# Altium project main_board.PrjPcb (part 1 of 2)
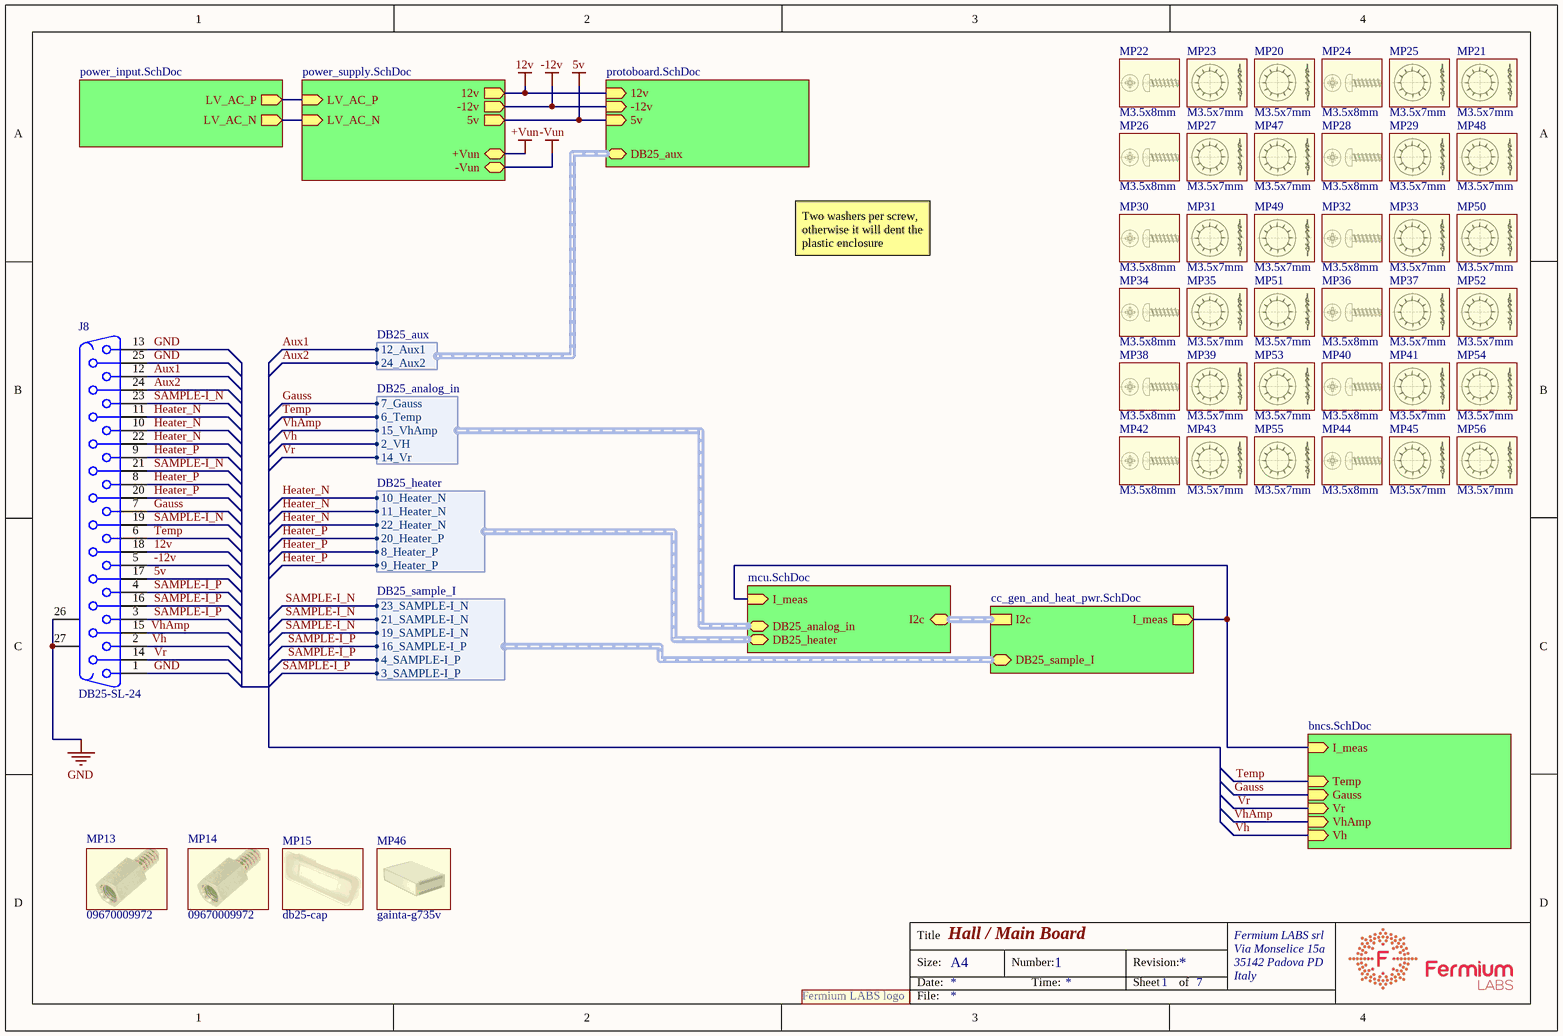
[diagram p0: main_board.SchDoc]
7 sheets, 247 parts. Net scope: hierarchical (ports join the sheet entries above them; power ports are global).
Board file: main_board.PcbDoc
Sheets:
  main_board.SchDoc
     = bncs.SchDoc
     = mcu.SchDoc
     = power_supply.SchDoc
     = cc_gen_and_heat_pwr.SchDoc
     = protoboard.SchDoc
     = power_input.SchDoc

## Sheet main_board.SchDoc: Hall / Main Board
size A4; DocumentNumber: 1; SheetNumber: 1; SheetTotal: 7

### Parts
J8  Supplier Part Number 1: DB25-SL-24  [DB25]
logo  (no value)  [frm-med]  (no BOM)
MP13  09670009972  (mechanical)
MP14  09670009972  (mechanical)
MP15  db25-cap  (mechanical)
MP20  Size: M3.5x7mm  (hidden comment: rondella-dentata-m3.5_1)  (mechanical)
MP21  Size: M3.5x7mm  (hidden comment: rondella-dentata-m3.5_1)  (mechanical)
MP22  Size: M3.5x8mm  (hidden comment: screw-3.5x8-plasticc_1)  (mechanical)
MP23  Size: M3.5x7mm  (hidden comment: rondella-dentata-m3.5_1)  (mechanical)
MP24  Size: M3.5x8mm  (hidden comment: screw-3.5x8-plasticc_1)  (mechanical)
MP25  Size: M3.5x7mm  (hidden comment: rondella-dentata-m3.5_1)  (mechanical)
MP26  Size: M3.5x8mm  (hidden comment: screw-3.5x8-plasticc_1)  (mechanical)
MP27  Size: M3.5x7mm  (hidden comment: rondella-dentata-m3.5_1)  (mechanical)
MP28  Size: M3.5x8mm  (hidden comment: screw-3.5x8-plasticc_1)  (mechanical)
MP29  Size: M3.5x7mm  (hidden comment: rondella-dentata-m3.5_1)  (mechanical)
MP30  Size: M3.5x8mm  (hidden comment: screw-3.5x8-plasticc_1)  (mechanical)
MP31  Size: M3.5x7mm  (hidden comment: rondella-dentata-m3.5_1)  (mechanical)
MP32  Size: M3.5x8mm  (hidden comment: screw-3.5x8-plasticc_1)  (mechanical)
MP33  Size: M3.5x7mm  (hidden comment: rondella-dentata-m3.5_1)  (mechanical)
MP34  Size: M3.5x8mm  (hidden comment: screw-3.5x8-plasticc_1)  (mechanical)
MP35  Size: M3.5x7mm  (hidden comment: rondella-dentata-m3.5_1)  (mechanical)
MP36  Size: M3.5x8mm  (hidden comment: screw-3.5x8-plasticc_1)  (mechanical)
MP37  Size: M3.5x7mm  (hidden comment: rondella-dentata-m3.5_1)  (mechanical)
MP38  Size: M3.5x8mm  (hidden comment: screw-3.5x8-plasticc_1)  (mechanical)
MP39  Size: M3.5x7mm  (hidden comment: rondella-dentata-m3.5_1)  (mechanical)
MP40  Size: M3.5x8mm  (hidden comment: screw-3.5x8-plasticc_1)  (mechanical)
MP41  Size: M3.5x7mm  (hidden comment: rondella-dentata-m3.5_1)  (mechanical)
MP42  Size: M3.5x8mm  (hidden comment: screw-3.5x8-plasticc_1)  (mechanical)
MP43  Size: M3.5x7mm  (hidden comment: rondella-dentata-m3.5_1)  (mechanical)
MP44  Size: M3.5x8mm  (hidden comment: screw-3.5x8-plasticc_1)  (mechanical)
MP45  Size: M3.5x7mm  (hidden comment: rondella-dentata-m3.5_1)  (mechanical)
MP46  gainta-g735v  (mechanical)
MP47  Size: M3.5x7mm  (hidden comment: rondella-dentata-m3.5_1)  (mechanical)
MP48  Size: M3.5x7mm  (hidden comment: rondella-dentata-m3.5_1)  (mechanical)
MP49  Size: M3.5x7mm  (hidden comment: rondella-dentata-m3.5_1)  (mechanical)
MP50  Size: M3.5x7mm  (hidden comment: rondella-dentata-m3.5_1)  (mechanical)
MP51  Size: M3.5x7mm  (hidden comment: rondella-dentata-m3.5_1)  (mechanical)
MP52  Size: M3.5x7mm  (hidden comment: rondella-dentata-m3.5_1)  (mechanical)
MP53  Size: M3.5x7mm  (hidden comment: rondella-dentata-m3.5_1)  (mechanical)
MP54  Size: M3.5x7mm  (hidden comment: rondella-dentata-m3.5_1)  (mechanical)
MP55  Size: M3.5x7mm  (hidden comment: rondella-dentata-m3.5_1)  (mechanical)
MP56  Size: M3.5x7mm  (hidden comment: rondella-dentata-m3.5_1)  (mechanical)

### Sub-sheets
? = bncs.SchDoc: Temp (in), Gauss (in), I_meas (in), Vr (in), VhAmp (in), Vh (in)
? = mcu.SchDoc: I2c (harness I2c), I_meas (in), DB25_analog_in (harness DB25_analog_in), DB25_heater (harness DB25_heater)
? = power_supply.SchDoc: 12v (out), -12v (out), 5v (out), LV_AC_P (in), LV_AC_N (in), +Vun, -Vun
? = cc_gen_and_heat_pwr.SchDoc: I2c (harness I2c), I_meas (out), DB25_sample_I (harness DB25_sample_I)
? = protoboard.SchDoc: 12v (in), -12v (in), 5v (in), DB25_aux (harness DB25_aux)
? = power_input.SchDoc: LV_AC_P (out), LV_AC_N (out)

### Harnesses
DB25_analog_in: 14_Vr, 15_VhAmp, 2_VH, 6_Temp, 7_Gauss
DB25_heater: 10_Heater_N, 11_Heater_N, 20_Heater_P, 22_Heater_N, 8_Heater_P, 9_Heater_P
DB25_sample_I: 16_SAMPLE-I_P, 19_SAMPLE-I_N, 21_SAMPLE-I_N, 23_SAMPLE-I_N, 3_SAMPLE-I_P, 4_SAMPLE-I_P
DB25_aux: 12_Aux1, 24_Aux2

### Nets
5v: J8.17 ; sheet /5v, sheet /5v
12v: J8.18 ; sheet /12v, sheet /12v
-12v: J8.5 ; sheet /-12v, sheet /-12v
GND: J8.1 J8.13 J8.25 J8.26(MH1) J8.27(MH2)
Aux1: J8.12 ; sheet /DB25_aux.12_Aux1
Aux2: J8.24 ; sheet /DB25_aux.24_Aux2
Gauss: J8.7 ; sheet /Gauss, sheet /DB25_analog_in.7_Gauss
Heater_N: J8.10 J8.11 J8.22 ; sheet /DB25_heater.10_Heater_N, sheet /DB25_heater.11_Heater_N, sheet /DB25_heater.22_Heater_N
Heater_P: J8.8 J8.9 J8.20 ; sheet /DB25_heater.20_Heater_P, sheet /DB25_heater.8_Heater_P, sheet /DB25_heater.9_Heater_P
SAMPLE-I_N: J8.19 J8.21 J8.23 ; sheet /DB25_sample_I.19_SAMPLE-I_N, sheet /DB25_sample_I.21_SAMPLE-I_N, sheet /DB25_sample_I.23_SAMPLE-I_N
SAMPLE-I_P: J8.3 J8.4 J8.16 ; sheet /DB25_sample_I.16_SAMPLE-I_P, sheet /DB25_sample_I.3_SAMPLE-I_P, sheet /DB25_sample_I.4_SAMPLE-I_P
Temp: J8.6 ; sheet /Temp, sheet /DB25_analog_in.6_Temp
Vh: J8.2 ; sheet /Vh, sheet /DB25_analog_in.2_VH
VhAmp: J8.15 ; sheet /VhAmp, sheet /DB25_analog_in.15_VhAmp
Vr: J8.14 ; sheet /Vr, sheet /DB25_analog_in.14_Vr
NetD1_A: sheet /I_meas, sheet /I_meas, sheet /I_meas
NetD19_A: sheet /LV_AC_P, sheet /LV_AC_P
NetD20_A: sheet /LV_AC_N, sheet /LV_AC_N

### Notes on the sheet
- Two washers per screw, otherwise it will dent the plastic enclosure
- Title
- Size:
- Date:
- A4
- Number:
- Time:
- Revision:
- Sheet
- of
- Fermium LABS srl
- Via Monselice 15a
- 35142 Padova PD
- Italy
- File:
- (in symbol fermiumlabs-logo) Fermium LABS logo

### Library data of the parts
J8 = D Connector 25: d-sub, 25 pins,  Right Angle; Manufacturer: ADAM TECH; Pads: 29 THT; Supplier 1: TME; Manufacturer Part Number: DB25-SL-24; Category: D-Sub connectors
logo = fermiumlabs-logo
MP13 MP14 = 09670009972: Manufacturer: HARTING; Supplier 1: TME; Supplier Part Number 1: 09670009972; Manufacturer Part Number: 09670009972
MP15 = db25-cap: Manufacturer Part Number: 2105-0100-03; Manufacturer: Encitech; Supplier 1: TME; Supplier Part Number 1: DC25-P
MP20 MP21 MP23 MP25 MP27 MP29 MP31 MP33 MP35 MP37 MP39 MP41 MP43 MP45 MP47-MP56 = rondella-dentata-m3.5_1: Manufacturer Part Number: M3.5/BN782 DIN6798J; Manufacturer: BOSSARD; Supplier 1: TME; Supplier Part Number 1: B3.5/BN782
MP22 MP24 MP26 MP28 MP30 MP32 MP34 MP36 MP38 MP40 MP42 MP44 = screw-3.5x8-plasticc_1: Manufacturer Part Number: M3.5X8/BN82428; Manufacturer: BOSSARD; Supplier 1: TME; Supplier Part Number 1: B3.5X8/BN82428
MP46 = gainta-g735v: Manufacturer Part Number: G735V; Manufacturer: GAINTA; Supplier 1: TME; Supplier Part Number 1: G735V

## Sheet bncs.SchDoc: Hall / Main Board / BNCs
size A4; DocumentNumber: 2; SheetNumber: 2; SheetTotal: 7
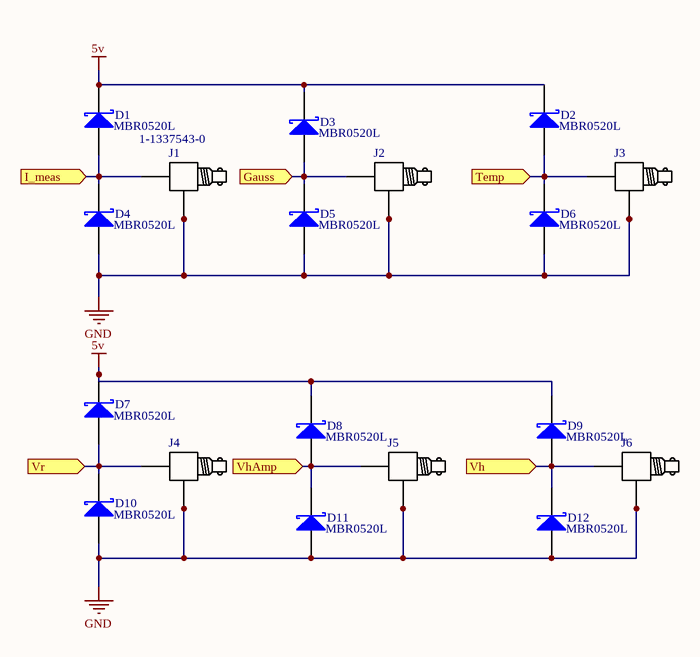
[diagram p1: bncs.SchDoc]

### Parts
D1  Supplier Part Number 1: MBR0520L  [SOD123]
D2  Supplier Part Number 1: MBR0520L  [SOD123]
D3  Supplier Part Number 1: MBR0520L  [SOD123]
D4  Supplier Part Number 1: MBR0520L  [SOD123]
D5  Supplier Part Number 1: MBR0520L  [SOD123]
D6  Supplier Part Number 1: MBR0520L  [SOD123]
D7  Supplier Part Number 1: MBR0520L  [SOD123]
D8  Supplier Part Number 1: MBR0520L  [SOD123]
D9  Supplier Part Number 1: MBR0520L  [SOD123]
D10  Supplier Part Number 1: MBR0520L  [SOD123]
D11  Supplier Part Number 1: MBR0520L  [SOD123]
D12  Supplier Part Number 1: MBR0520L  [SOD123]
J1  Supplier Part Number 1: 1-1337543-0  [BNC-RA]
J2  (no value)  [BNC-RA]
J3  (no value)  [BNC-RA]
J4  (no value)  [BNC-RA]
J5  (no value)  [BNC-RA]
J6  (no value)  [BNC-RA]

### Ports
Gauss (in), I_meas (in), Temp (in), Vh (in), VhAmp (in), Vr (in)

### Nets
5v: D1.K D2.K D3.K D7.K D8.K D9.K
GND: D4.A D5.A D6.A D10.A D11.A D12.A J1.2(gnd) J1.A J1.B J2.2(gnd) J2.A J2.B J3.2(gnd) J3.A J3.B J4.2(gnd) J4.A J4.B J5.2(gnd) J5.A J5.B J6.2(gnd) J6.A J6.B
Gauss: D3.A D5.K J2.1 ; port Gauss
Temp: D2.A D6.K J3.1 ; port Temp
Vh: D9.A D12.K J6.1 ; port Vh
VhAmp: D8.A D11.K J5.1 ; port VhAmp
Vr: D7.A D10.K J4.1 ; port Vr
NetD1_A: D1.A D4.K J1.1 ; port I_meas

### Notes on the sheet
- Title
- Size:
- Date:
- A4
- Number:
- Time:
- Revision:
- Sheet
- of
- Fermium LABS srl
- Via Monselice 15a
- 35142 Padova PD
- Italy
- File:

### Library data of the parts
D1-D9 D11 D12 = D Schottky: Schottky Diode; Manufacturer: FAIRCHILD SEMICONDUCTOR; Unit: pcs; SuppliedAmount: 0; MinAmount: 10; Multiples: 1; Diode type: Schottky rectifying; Off state voltage max.: 20V; Forward voltage at If: 390mV; Load current: 500mA; Pads: 2 SMD; Published: 8-Jun-2000; LatestRevisionDate: 17-Jul-2002; LatestRevisionNote: Re-released for DXP Platform.; PackageReference: SMB; Publisher: Altium Limited; PackageDescription: DO-214-AA/SMB; 2 C-Bend Leads; Body 5.3 x 3.6 mm, inc. leads (LxW); Code_JEDEC: DO-214-AA; Supplier 1: TME; Manufacturer Part Number: MBR0520L; Category: SMD Schottky Diodes; Stock 1: 24595; Pricing 1: 10=0.0403, 50=0.0376, 250=0.0333, 1000=0.03, 3000=0.0281 (EUR); Weight: 0.032; Case: SOD123; Mounting: SMD; Price Type: NET; ComponentLink1URL: http://static.tme.eu/products_pics/e/d/b/edbd030cb344fc64745afa0f91101952/285567.jpg; ComponentLink1Description: http://static.tme.eu/products_pics/e/d/b/edbd030cb344fc64745afa0f91101952/285567.jpg
D10 = D Schottky: Schottky Diode; Manufacturer: FAIRCHILD SEMICONDUCTOR; Unit: pcs; SuppliedAmount: 0; MinAmount: 10; Multiples: 1; Diode type: Schottky rectifying; Off state voltage max.: 20V; Forward voltage at If: 390mV; Load current: 500mA; 2: SMD; Pads: 2 SMD; Published: 8-Jun-2000; LatestRevisionDate: 17-Jul-2002; LatestRevisionNote: Re-released for DXP Platform.; PackageReference: SMB; Publisher: Altium Limited; PackageDescription: DO-214-AA/SMB; 2 C-Bend Leads; Body 5.3 x 3.6 mm, inc. leads (LxW); Code_JEDEC: DO-214-AA; Supplier 1: TME; Manufacturer Part Number: MBR0520L; Category: SMD Schottky Diodes; Stock 1: 24595; Pricing 1: 10=0.0403, 50=0.0376, 250=0.0333, 1000=0.03, 3000=0.0281 (EUR); Weight: 0.032; Case: SOD123; Mounting: SMD; Price Type: NET; ComponentLink1URL: http://static.tme.eu/products_pics/e/d/b/edbd030cb344fc64745afa0f91101952/285567.jpg; ComponentLink1Description: http://static.tme.eu/products_pics/e/d/b/edbd030cb344fc64745afa0f91101952/285567.jpg
J1 = BNC-PCB-RA: connector bnc; Manufacturer: TE CONNECTIVITY; Unit: pcs; SuppliedAmount: 0; MinAmount: 1; Connector: socket; Connector variant: insulated; Spatial orientation: angled 90°; Wave impedance: 50Ω; Electrical mounting: THT; Mechanical mounting: on PCBs; Insulator material: polyester; Pads: 4 THT; Supplier 1: TME; Manufacturer Part Number: 1-1337543-0; Category: BNC connectors; Stock 1: 44; Pricing 1: 1=1.22, 25=1.1, 100=0.98, 1000=0.86 (EUR); Weight: 13.22; Multiples: 1; Connector type: BNC; Contact plating: gold plated; Price Type: NET; ComponentLink1URL: http://static.tme.eu/products_pics/6/3/2/63240353f8a8790dbe8f7bd93b014c1a/378606.jpg; ComponentLink1Description: http://static.tme.eu/products_pics/6/3/2/63240353f8a8790dbe8f7bd93b014c1a/378606.jpg
J2-J6 = BNC-PCB-RA: connector bnc; Manufacturer: TE CONNECTIVITY; Manufacturer Part Number: 1-1337543-0; Unit: pcs; SuppliedAmount: 0; MinAmount: 1; Connector: socket; Connector variant: insulated; Spatial orientation: angled 90°; Wave impedance: 50Ω; Electrical mounting: THT; Mechanical mounting: on PCBs; Insulator material: polyester; Pads: 4 THT; Supplier 1: TME; Supplier Part Number 1: 1-1337543-0; Category: BNC connectors; Stock 1: 44; Pricing 1: 1=1.22, 25=1.1, 100=0.98, 1000=0.86 (EUR); Weight: 13.22; Multiples: 1; Connector type: BNC; Contact plating: gold plated; Price Type: NET; ComponentLink1URL: http://static.tme.eu/products_pics/6/3/2/63240353f8a8790dbe8f7bd93b014c1a/378606.jpg; ComponentLink1Description: http://static.tme.eu/products_pics/6/3/2/63240353f8a8790dbe8f7bd93b014c1a/378606.jpg

## Sheet mcu.SchDoc: Hall / Main Board / MCU and ADCs
size A4; DocumentNumber: 4; SheetNumber: 4; SheetTotal: 7
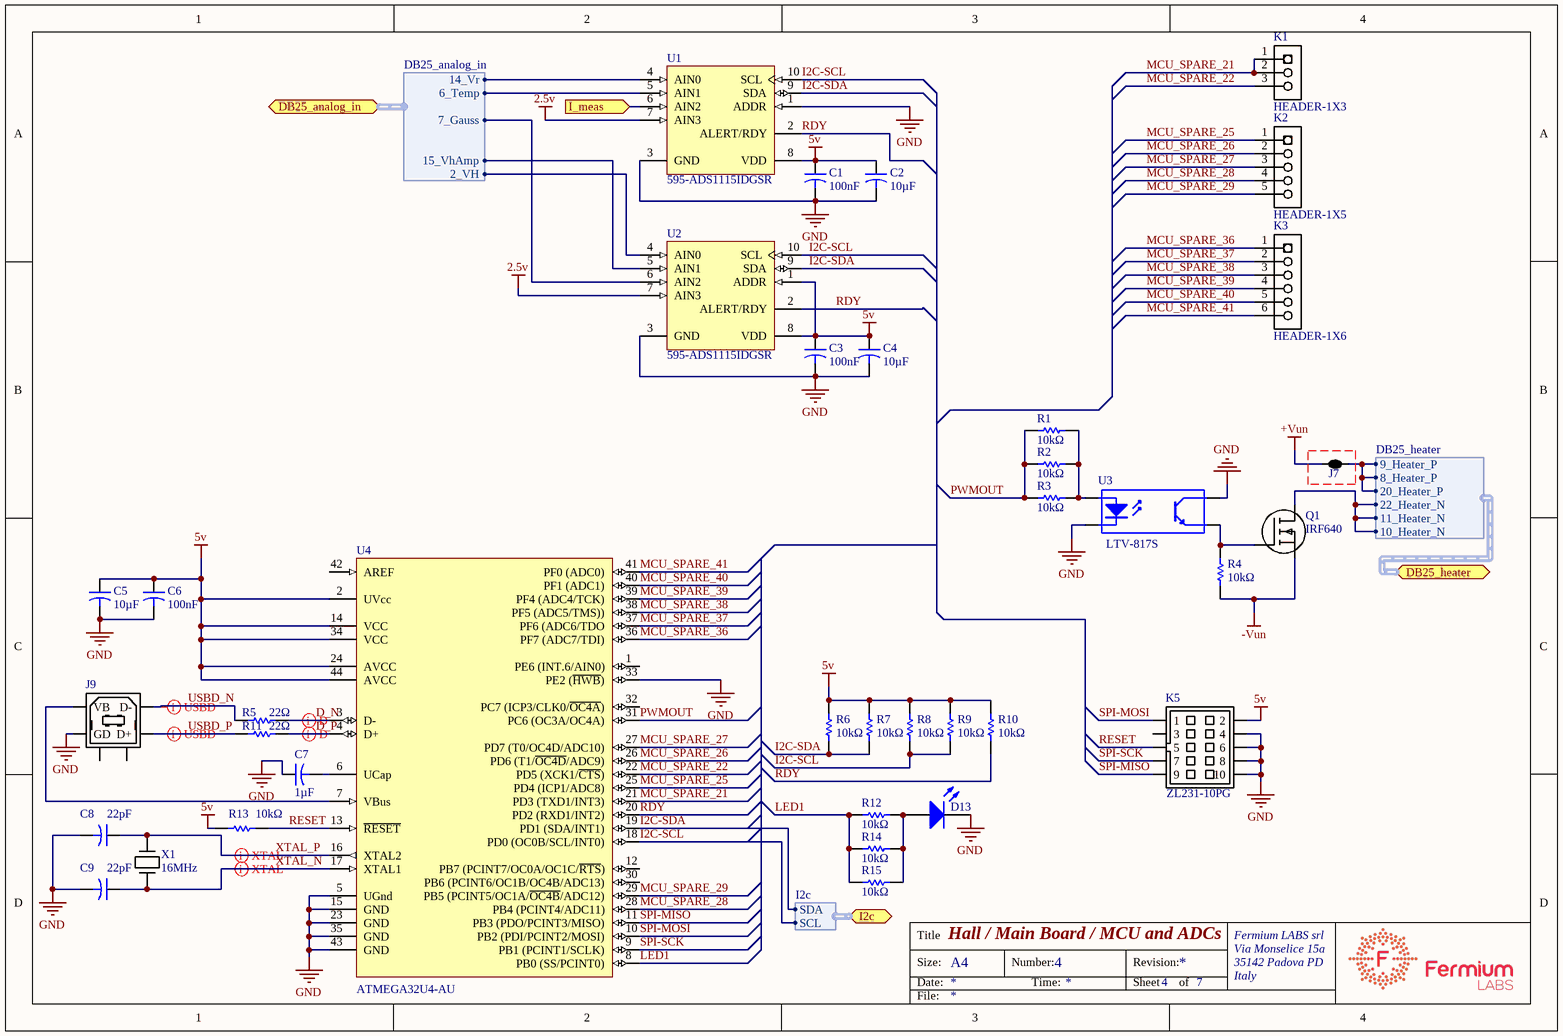
[diagram p2: mcu.SchDoc]

### Parts
C1  Capacitance: 100nF  [CAP 0805/2012]
C2  Capacitance: 10µF  [CAP 1206/3216]
C3  Capacitance: 100nF  [CAP 0805/2012]
C4  Capacitance: 10µF  [CAP 1206/3216]
C5  Capacitance: 10µF  [CAP 1206/3216]
C6  Capacitance: 100nF  [CAP 0805/2012]
C7  Capacitance: 1µF  [CAP 0805/2012]
C8  Capacitance: 22pF  [CAP 0805/2012]
C9  Capacitance: 22pF  [CAP 0805/2012]
D13  (no value)  [LED-0]
J7  2 way net tie junction  [2way_LP]  (value not drawn)  (net tie, no BOM)
J9  (no value)  [USB_TypeB]
K1  HEADER-1X3  [HEADER-1X3]  (no BOM)
K2  HEADER-1X5  [HEADER-1X5]  (no BOM)
K3  HEADER-1X6  [HEADER-1X6]  (no BOM)
K5  Supplier Part Number 1: ZL231-10PG  [IDC10-B]
Q1  IRF640  [DPAK-GDS]
R1  Resistance: 10kΩ  [RES 0805/2012]
R2  Resistance: 10kΩ  [RES 0805/2012]
R3  Resistance: 10kΩ  [RES 0805/2012]
R4  Resistance: 10kΩ  [RES 0805/2012]
R5  Resistance: 22Ω  [RES 0805/2012]
R6  Resistance: 10kΩ  [RES 0805/2012]
R7  Resistance: 10kΩ  [RES 0805/2012]
R8  Resistance: 10kΩ  [RES 0805/2012]
R9  Resistance: 10kΩ  [RES 0805/2012]
R10  Resistance: 10kΩ  [RES 0805/2012]
R11  Resistance: 22Ω  [RES 0805/2012]
R12  Resistance: 10kΩ  [RES 0805/2012]
R13  Resistance: 10kΩ  [RES 0805/2012]  (hidden comment: Res1)
R14  Resistance: 10kΩ  [RES 0805/2012]
R15  Resistance: 10kΩ  [RES 0805/2012]
U1  Supplier Part Number 1: 595-ADS1115IDGSR  [TI-DGS10_N]
U2  Supplier Part Number 1: 595-ADS1115IDGSR  [TI-DGS10_N]
U3  Supplier Part Number 1: LTV-817S  [gullwing-opto-4]  (hidden comment: LTV-817)
U4  (no value)  [44ML_N]
X1  Frequency: 16MHz  [ABRACON ABLS]

### Ports
DB25_analog_in (harness DB25_analog_in), DB25_heater (harness DB25_heater), I2c (harness I2c), I_meas (in)

### Harnesses
DB25_analog_in: 14_Vr, 15_VhAmp, 2_VH, 6_Temp, 7_Gauss
I2c: SCL, SDA
DB25_heater: 10_Heater_N, 11_Heater_N, 20_Heater_P, 22_Heater_N, 8_Heater_P, 9_Heater_P

### Nets
2.5v: U1.7(AIN3) U2.7(AIN3)
5v: C1.1 C2.1 C3.1 C4.1 C5.1 C6.1 K5.2 R6.2 R7.2 R8.2 R9.2 R10.2 R13.2 U1.8(VDD) U2.1(ADDR) U2.8(VDD) U4.2(UVcc) U4.14(VCC) U4.24(AVCC) U4.34(VCC) U4.44(AVCC)
+Vun: J7.1
-Vun: Q1.S R4.1
GND: C1.2 C2.2 C3.2 C4.2 C5.2 C6.2 C7.1 C8.2 C9.2 D13.1(K) J9.4(GD) K5.4 K5.6 K5.8 K5.10 U1.1(ADDR) U1.3(GND) U2.3(GND) U3.2(K) U3.4(C) U4.5(UGnd) U4.15(GND) U4.23(GND) U4.33(PE2_(~{HWB})) U4.35(GND) U4.43(GND)
D_N: R5.1 U4.3(D-)
D_P: R11.1 U4.4(D+)
Gauss: U2.6(AIN2) ; port DB25_analog_in.7_Gauss
Heater_N: Q1.D ; port DB25_heater.10_Heater_N, port DB25_heater.11_Heater_N, port DB25_heater.22_Heater_N
Heater_P: J7.2 ; port DB25_heater.20_Heater_P, port DB25_heater.8_Heater_P, port DB25_heater.9_Heater_P
I2C-SCL: R8.1 R9.1 U1.10(SCL) U2.10(SCL) U4.18(PD0_(OC0B/SCL/INT0)) ; port I2c.SCL
I2C-SDA: R6.1 R7.1 U1.9(SDA) U2.9(SDA) U4.19(PD1_(SDA/INT1)) ; port I2c.SDA
LED1: R12.2 R14.2 R15.2 U4.8(PB0_(SS/PCINT0))
MCU_SPARE_21: K1.1 K1.2 U4.21(PD3_(TXD1/INT3))
MCU_SPARE_22: K1.3 U4.22(PD5_(XCK1/~{CTS}))
MCU_SPARE_25: K2.1 U4.25(PD4_(ICP1/ADC8))
MCU_SPARE_26: K2.2 U4.26(PD6_(T1/~{OC4D}/ADC9))
MCU_SPARE_27: K2.3 U4.27(PD7_(T0/OC4D/ADC10))
MCU_SPARE_28: K2.4 U4.28(PB4_(PCINT4/ADC11))
MCU_SPARE_29: K2.5 U4.29(PB5_(PCINT5/OC1A/~{OC4B}/ADC12))
MCU_SPARE_36: K3.1 U4.36(PF7_(ADC7/TDI))
MCU_SPARE_37: K3.2 U4.37(PF6_(ADC6/TDO)
MCU_SPARE_38: K3.3 U4.38(PF5_(ADC5/TMS)))
MCU_SPARE_39: K3.4 U4.39(PF4_(ADC4/TCK))
MCU_SPARE_40: K3.5 U4.40(PF1_(ADC1))
MCU_SPARE_41: K3.6 U4.41(PF0_(ADC0))
PWMOUT: R1.2 R2.2 R3.2 U4.31(PC6_(OC3A/OC4A))
RDY: R10.1 U1.2(ALERT/RDY) U2.2(ALERT/RDY) U4.20(PD2_(RXD1/INT2))
RESET: K5.5 R13.1 U4.13(~{RESET})
SPI-MISO: K5.9 U4.11(PB3_(PDO/PCINT3/MISO))
SPI-MOSI: K5.1 U4.10(PB2_(PDI/PCINT2/MOSI))
SPI-SCK: K5.7 U4.9(PB1_(PCINT1/SCLK))
Temp: U1.5(AIN1) ; port DB25_analog_in.6_Temp
USBD_N: J9.2(D-) R5.2
USBD_P: J9.3(D+) R11.2
Vh: U2.4(AIN0) ; port DB25_analog_in.2_VH
VhAmp: U2.5(AIN1) ; port DB25_analog_in.15_VhAmp
Vr: U1.4(AIN0) ; port DB25_analog_in.14_Vr
XTAL_N: C9.1 U4.17(XTAL1) X1.2
XTAL_P: C8.1 U4.16(XTAL2) X1.1
NetC7_2: C7.2 U4.6(UCap)
NetD1_A: U1.6(AIN2) ; port I_meas
NetD13_2: D13.2(A) R12.1 R14.1 R15.1
NetJ9_1: J9.1(VB) U4.7(VBus)
NetQ1_G: Q1.G R4.2 U3.3(E)
NetR1_1: R1.1 R2.1 R3.1 U3.1(A)

Not connected (* = marked no-connect by the designer): J9 5 6; K5 3; U4 1(PE6_(INT.6/AIN0)) 12(PB7_(PCINT7/OC0A/OC1C/~{RTS})) 30(PB6_(PCINT6/OC1B/OC4B/ADC13)) 32(PC7_(ICP3/CLK0/~{OC4A})) 42(AREF)

### Layout directives
differential pair: D_N, D_P, USBD_N, USBD_P, XTAL_N, XTAL_P

### Notes on the sheet
- Title
- Size:
- Date:
- A4
- Number:
- Time:
- Revision:
- Sheet
- of
- Fermium LABS srl
- Via Monselice 15a
- 35142 Padova PD
- Italy
- File:

### Library data of the parts
C1 C3 C6 = Cap2: Capacitor; Manufacturer: YAGEO; Manufacturer Part Number: CC0805JRX7R9BB104; Unit: pcs; SuppliedAmount: 0; MinAmount: 100; Capacitor type: ceramic; Capacitor kind: MLCC; Operating voltage: 50V; Dielectric: X7R; Tolerance: ±5%; Case - inch: 0805; Case - mm: 2012; Pads: 2 SMD; Supplier 1: TME; Supplier Part Number 1: CC0805JRX7R9104; Category: 0805 MLCC SMD Capacitors; Stock 1: 89911; Pricing 1: 100=0.00613, 300=0.00464, 1000=0.00342, 4000=0.00284, 20000=0.00273 (EUR); Weight: 0.042; Multiples: 100; Mounting: SMD; Price Type: NET; ComponentLink1URL: http://static.tme.eu/products_pics/d/b/b/dbbd93eaf25225110ca26eb66da77328/58538.jpg; ComponentLink1Description: http://static.tme.eu/products_pics/d/b/b/dbbd93eaf25225110ca26eb66da77328/58538.jpg
C2 C4 C5 = Cap2: Capacitor; Manufacturer: SAMSUNG; Manufacturer Part Number: CL31A106KAHNNNE; Unit: pcs; SuppliedAmount: 0; MinAmount: 100; Capacitor type: ceramic; Capacitor kind: MLCC; Operating voltage: 25V; Dielectric: X5R; Tolerance: ±10%; Case - inch: 1206; Case - mm: 3216; Pads: 2 SMD; Published: 23-Sep-2002; PackageReference: CAPR5-4X5; Publisher: Altium Limited; PackageDescription: 1206; Supplier 1: TME; Supplier Part Number 1: CL31A106KAHNNNE; Category: 1206 MLCC SMD Capacitors; Stock 1: 279700; Pricing 1: 100=0.0248, 300=0.0203, 1000=0.0167, 2000=0.0131, 10000=0.0127 (EUR); Weight: 0.061; Multiples: 100; Mounting: SMD; Operating temperature: -55...85°C; Price Type: NET; ComponentLink1URL: http://static.tme.eu/products_pics/b/e/9/be9e0dd298dcf4979ea1dd3d226e0bfa/58780.jpg; ComponentLink1Description: http://static.tme.eu/products_pics/b/e/9/be9e0dd298dcf4979ea1dd3d226e0bfa/58780.jpg
C7 = Cap2: Capacitor; Manufacturer: SAMSUNG; Manufacturer Part Number: CL21B105KAFNNNE; Unit: pcs; SuppliedAmount: 0; MinAmount: 100; Capacitor type: ceramic; Capacitor kind: MLCC; Operating voltage: 25V; Dielectric: X7R; Tolerance: ±10%; Case - inch: 0805; Case - mm: 2012; Pads: 2 SMD; Published: 23-Sep-2002; PackageReference: CAPR5-4X5; Publisher: Altium Limited; PackageDescription: Capacitor; 2 Leads; Supplier 1: TME; Supplier Part Number 1: CL21B105KAFNNNE; Category: 0805 MLCC SMD Capacitors; Stock 1: 56790; Pricing 1: 100=0.0108, 300=0.00924, 1000=0.00748, 2000=0.006, 6000=0.0058 (EUR); Weight: 0.039; Multiples: 100; Mounting: SMD; Operating temperature: -55...125°C; Price Type: NET; ComponentLink1URL: http://static.tme.eu/products_pics/d/b/b/dbbd93eaf25225110ca26eb66da77328/58538.jpg; ComponentLink1Description: http://static.tme.eu/products_pics/d/b/b/dbbd93eaf25225110ca26eb66da77328/58538.jpg
C8 C9 = Cap2: Capacitor; Manufacturer: SAMSUNG; Manufacturer Part Number: CL21C220JBANNNC; Unit: pcs; SuppliedAmount: 0; MinAmount: 100; Capacitor type: ceramic; Capacitor kind: MLCC; Operating voltage: 50V; Dielectric: C0G; Tolerance: ±5%; Case - inch: 0805; Case - mm: 2012; Pads: 2 SMD; Published: 23-Sep-2002; PackageReference: CAPR5-4X5; Publisher: Altium Limited; PackageDescription: Capacitor; 2 Leads; Supplier 1: TME; Supplier Part Number 1: CL21C220JBANNNC; Category: 0805 MLCC SMD Capacitors; Stock 1: 298580; Pricing 1: 100=0.00603, 300=0.00435, 1000=0.00317, 4000=0.00171, 12000=0.00163 (EUR); Weight: 0.032; Multiples: 100; Mounting: SMD; Operating temperature: -55...125°C; Price Type: NET; ComponentLink1URL: http://static.tme.eu/products_pics/d/b/b/dbbd93eaf25225110ca26eb66da77328/58538.jpg; ComponentLink1Description: http://static.tme.eu/products_pics/d/b/b/dbbd93eaf25225110ca26eb66da77328/58538.jpg
D13 = LED0: LED red 5mm; Manufacturer: KINGBRIGHT ELECTRONIC; Manufacturer Part Number: L-1503CB/1ID; Unit: pcs; SuppliedAmount: 0; MinAmount: 5; Multiples: 1; LED version: in housing; Front: convex; LED lens: diffused; LED current: 20mA; Viewing angle: 60°; Operating voltage: 2...2.5V; Luminosity: 8-30mcd; Wavelength: 625nm; Pads: 2 THT; Supplier 1: TME; Supplier Part Number 1: L-1503CB/1ID; Category: LED Circuit Board Indicators; Stock 1: 1055; Pricing 1: 5=0.1308, 10=0.11837, 25=0.10529, 100=0.09483, 500=0.08829 (EUR); Weight: 0.4; Diode type: LED; LED colour: red; Mounting: THT; LED diameter: 5mm; Number of diodes: 1; Price Type: NET; ComponentLink1URL: http://static.tme.eu/products_pics/2/d/8/2d8734f7e5dfd4453dcfb445f87d0bf6/363629.jpg; ComponentLink1Description: http://static.tme.eu/products_pics/2/d/8/2d8734f7e5dfd4453dcfb445f87d0bf6/363629.jpg
J7 = 2way: ComponentLink1URL: http://www.edatools.cz/addons; ComponentLink1Description: Source; FootprintNote: LP=12mil, MP=40mil, HP=120mil
J9 = USB-B: USB b device connector; Manufacturer: LUMBERG; Manufacturer Part Number: 2411 02; Unit: pcs; SuppliedAmount: 0; MinAmount: 1; Connector: socket; Connector type: USB B; Mechanical mounting: on PCBs; Electrical mounting: THT; Spatial orientation: angled 90°; Variant: USB 2.0; Pads: 6 THT; Supplier 1: TME; Supplier Part Number 1: 2411-02; Category: USB & IEEE1394 connectors; Stock 1: 1211; Pricing 1: 1=0.58, 10=0.52, 50=0.46, 100=0.4 (EUR); Weight: 3.4; Multiples: 1; Number of pins: 4; Colour: white; Price Type: NET; ComponentLink1URL: http://static.tme.eu/products_pics/d/8/1/d81dedeb5f01696a6050c2c1b3ea9f71/397242.jpg; ComponentLink1Description: http://static.tme.eu/products_pics/d/8/1/d81dedeb5f01696a6050c2c1b3ea9f71/397242.jpg
K2 = HEADER-1X5: PINHEADER 1X5; REEL: TH; Supplier 1: Digi-Key; Supplier Part Number 1: S1011E-36-ND
K5 = IDC10: header 10pin, boxed; Manufacturer: NINIGI; Unit: pcs; SuppliedAmount: 0; MinAmount: 10; Connector: socket; Connector type: IDC; Spatial orientation: straight; Electrical mounting: THT; Contacts pitch: 2.54mm; Type of pin configuration: 2x5; Pads: 10 THT; Supplier 1: TME; Manufacturer Part Number: ZL231-10PG; Category: IDC connectors; Stock 1: 106380; Pricing 1: 10=0.08292, 50=0.07256, 200=0.06219, 1000=0.05183, 5000=0.04147 (EUR); Weight: 1.433; Multiples: 10; Number of pins: 10; Contact plating: gold plated; Price Type: NET; ComponentLink1URL: http://static.tme.eu/products_pics/2/9/e/29e35db67837c6e13659dd28b2765932/375255.jpg; ComponentLink1Description: http://static.tme.eu/products_pics/2/9/e/29e35db67837c6e13659dd28b2765932/375255.jpg
Q1 = IRLML2502: N CHANNEL MOSFET; Manufacturer Part Number: IRF640NSPBF; Pads: 3 SMD; Supplier 1: TME; Supplier Part Number 1: IRF640NSPBF
R1-R4 R6-R10 R12-R15 = Res1: Resistor; Manufacturer: YAGEO; Manufacturer Part Number: RC0805JR-0710KL; Unit: pcs; SuppliedAmount: 0; MinAmount: 100; Case - inch: 0805; Case - mm: 2012; Power: 0.125W; Tolerance: ±5%; Max. operating voltage: 150V; Max. overload voltage: 300V; Pads: 2 SMD; Published: 8-Jun-2000; LatestRevisionDate: 17-Jul-2002; LatestRevisionNote: Re-released for DXP Platform.; PackageReference: AXIAL-0.3; Publisher: Altium Limited; PackageDescription: Axial Device, Thru-Hole; 2 Leads; 0.3 in Pin Spacing; Supplier 1: TME; Supplier Part Number 1: RC0805JR-0710K; Category: 0805 SMD Resistors; Stock 1: 121900; Pricing 1: 100=0.006, 1000=0.0036, 5000=0.00118, 15000=0.00108, 50000=0.00094 (EUR); Weight: 0.028; Multiples: 100; Resistor type: thick film; Mounting: SMD; Operating temperature: -55...155°C; Price Type: NET; ComponentLink1URL: http://static.tme.eu/products_pics/6/6/c/66cc5cd64257edd80ca8e9fd2040972d/56038.jpg; ComponentLink1Description: http://static.tme.eu/products_pics/6/6/c/66cc5cd64257edd80ca8e9fd2040972d/56038.jpg
R5 R11 = Res1: Resistor; Manufacturer: ROYAL OHM; Manufacturer Part Number: 0805S8F220JT5E; Unit: pcs; SuppliedAmount: 0; MinAmount: 100; Case - inch: 0805; Case - mm: 2012; Power: 0.125W; Tolerance: ±1%; Max. operating voltage: 150V; Max. overload voltage: 300V; Temperature coefficient: 200ppm/°C; Pads: 2 SMD; Supplier 1: TME; Supplier Part Number 1: SMD0805-22R-1%; Category: 0805 SMD Resistors; Stock 1: 22000; Pricing 1: 100=0.00846, 1000=0.00329, 5000=0.00113, 15000=0.00108, 50000=0.00103 (EUR); Weight: 0.031; Multiples: 100; Resistor type: thick film; Mounting: SMD; Operating temperature: -55...125°C; Price Type: NET; ComponentLink1URL: http://static.tme.eu/products_pics/a/3/4/a34f7a182e69d69fdfdb65c44b99ca64/60560.jpg; ComponentLink1Description: http://static.tme.eu/products_pics/a/3/4/a34f7a182e69d69fdfdb65c44b99ca64/60560.jpg
U1 U2 = ADS1115IDGSR: 16-Bit 4 channel ADC with PGA and reference; Manufacturer: Texas Instruments; Input Type: Differential/Single-Ended; Number of Converters: 1 Converter; Resolution: 16 bit; Sampling Rate: 860 S/s; Architecture: Sigma-Delta; Interface Type: Serial, 2-Wire, I2C; Number of Channels: 2 Channel/4 Channel; Reference Type: Internal; Analog Supply Voltage: 2 V to 5.5 V; INL - Integral Nonlinearity: 1 LSB; Pd - Power Dissipation: 900 uW; Pads: 8 SMD; Supplier 1: Mouser; Manufacturer Part Number: ADS1115IDGSR; RoHS: RoHS Compliant; Category: Analog to Digital Converters - ADC; Stock 1: 6215; Pricing 1: 1=4.96, 10=4.45, 25=4.15, 50=3.93, 100=3.65, 250=3.47, 500=3.10, 1000=2.43, 2500=2.43 (EUR); Features: PGA, Oscillator, Internal Reference, Comparator; Height: 1.02 mm; Length: 3 mm; Package / Case: VSSOP-10; Packaging: Reel; Product: Analog to Digital Converters; Series: ADS1115; Type: Precision ADC; Width: 3 mm; Brand: Texas Instruments; Mounting Style: SMD/SMT; Shutdown: Shutdown; Digital Supply Voltage: 2 V to 5.5 V; Maximum Operating Temperature: + 125 C; Minimum Operating Temperature: - 40 C; Operating Supply Voltage: 2 V to 5.5 V; Standard Pack Qty: 2500; RoHS - Mouser: Y; Minimum Order Quantity: 1; Reeling: True
U3 = Optoisolator1: 4-Pin Phototransistor Optocoupler; Manufacturer: LITEON; Unit: pcs; SuppliedAmount: 0; MinAmount: 5; Multiples: 1; Insulation voltage: 5kV; CTR@If: 50-600%@5mA; Collector-emitter voltage: 35V; Pads: 4 SMD; Published: 24-Mar-1999; LatestRevisionDate: 04-Mar-2005; LatestRevisionNote: Sch pins 3 & 4 Swapped.; DatasheetVersion: Nov-2003; PackageReference: DIP-4; Publisher: Altium Limited; Supplier 1: TME; Manufacturer Part Number: LTV-817S; Category: Optocouplers - Analog Output; Stock 1: 45338; Pricing 1: 5=0.0986, 10=0.0883, 25=0.0813, 250=0.0715 (EUR); Weight: 0.211; Type of semiconductor component: optocoupler; Mounting: SMD; Number of channels: 1; Output type: transistor; Case: Gull wing 4; Price Type: NET; ComponentLink1URL: http://static.tme.eu/products_pics/6/f/5/6f53ad03154050309bf911a8cef2b774/437233.jpg; ComponentLink1Description: http://static.tme.eu/products_pics/6/f/5/6f53ad03154050309bf911a8cef2b774/437233.jpg
U4 = ATmega32U4-AU: 8-bit AVR MCU, 16MHz, 32KB Flash, 1KB EEPROM, 2.5KB SRAM, USB; Manufacturer: ATMEL; Integrated circuit type: AVR microcontroller; Pads: 42 SMD; Supplier 1: TME; Supplier Part Number 1: ATMEGA32U4-AU; Manufacturer Part Number: ATMEGA32U4-AU; Case: TQFP44; Mounting: SMD
X1 = CRYSTAL-GENERIC: quartz crystal; Manufacturer: YIC; Unit: pcs; SuppliedAmount: 0; MinAmount: 2; Multiples: 1; Resonator tolerance: ±30ppm; Capacitance: 20pF; Power: 1mW; Time stability: ±5ppm/year; Pads: 2 SMD; Supplier 1: TME; Supplier Part Number 1: 16.00M-SMDHC49S; Category: SMD Quartz Crystals; Stock 1: 11958; Pricing 1: 2=0.3697, 10=0.2143, 100=0.1318, 1000=0.1033, 4000=0.0995 (EUR); Weight: 1.11; Resonator type: quartz; Mounting: SMD; Case: HC49SM; Price Type: NET; ComponentLink1URL: http://static.tme.eu/products_pics/0/4/3/0433aed25ec1f9097194a826a55aa53d/56913.jpg; ComponentLink1Description: http://static.tme.eu/products_pics/0/4/3/0433aed25ec1f9097194a826a55aa53d/56913.jpg
K1 = HEADER-1X3: Supplier 1: Digi-Key; Supplier Part Number 1: S1011E-36-ND
K3 = HEADER-1X6: Supplier 1: Digi-Key; Supplier Part Number 1: S1011E-36-ND

## Sheet power_supply.SchDoc: Hall / Main Board / Power Supply
size A4; DocumentNumber: 6; SheetNumber: 6; SheetTotal: 7
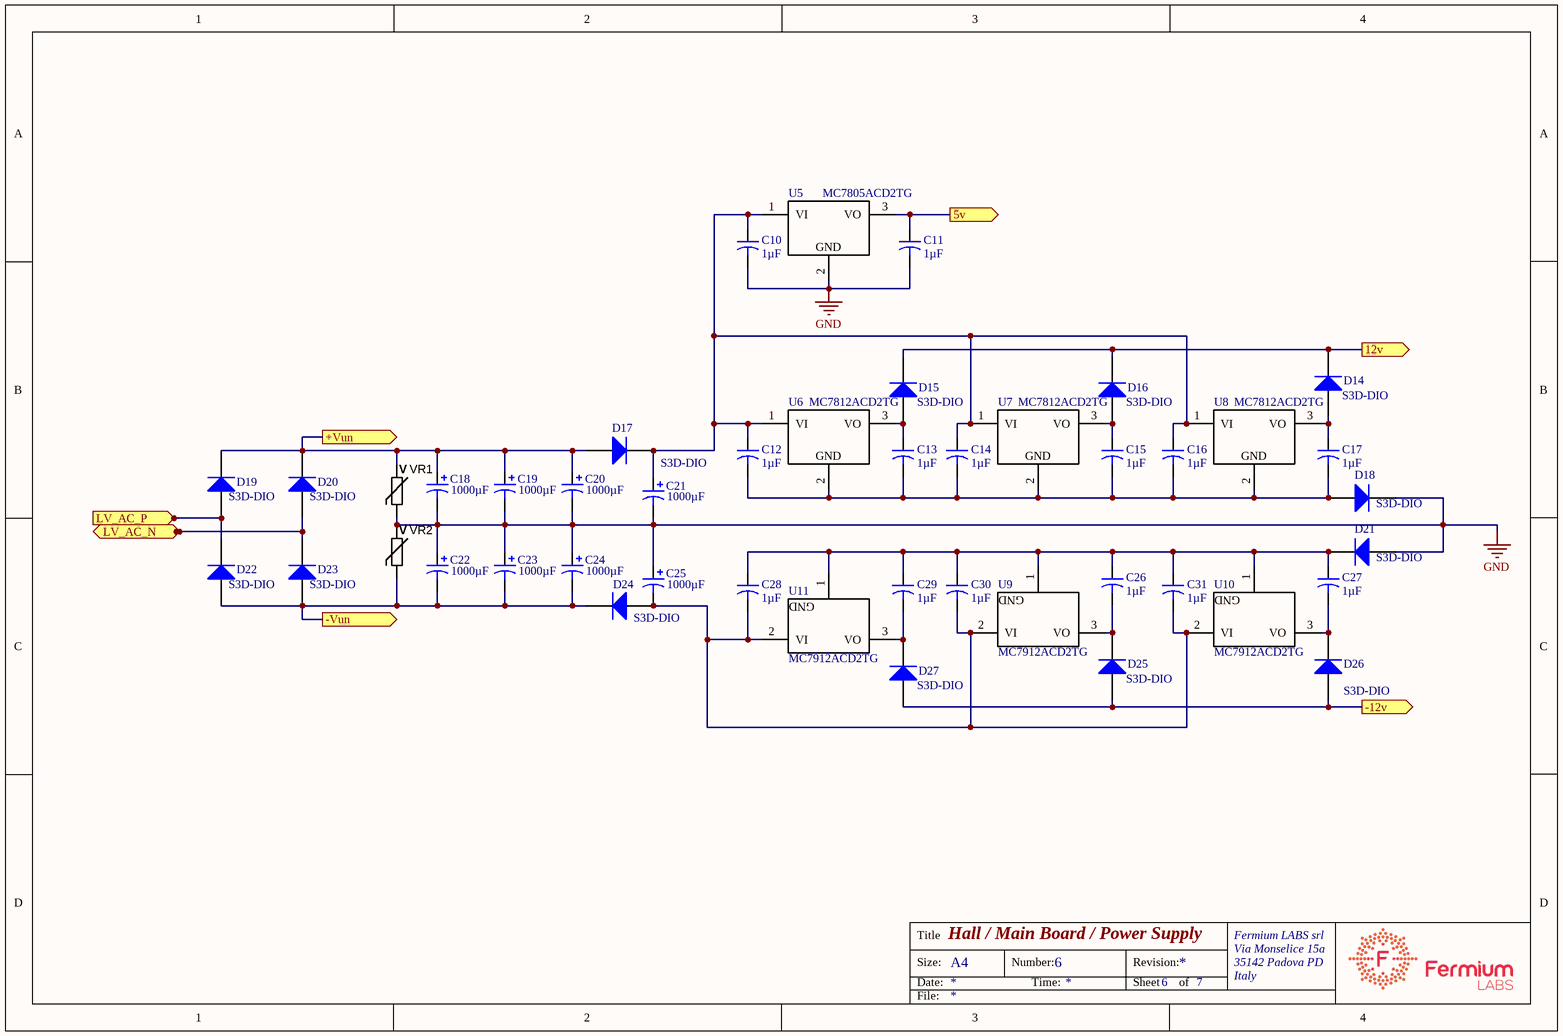
[diagram p3: power_supply.SchDoc]

### Parts
C10  Capacitance: 1µF  [CAP 0805/2012]
C11  Capacitance: 1µF  [CAP 0805/2012]
C12  Capacitance: 1µF  [CAP 0805/2012]
C13  Capacitance: 1µF  [CAP 0805/2012]
C14  Capacitance: 1µF  [CAP 0805/2012]
C15  Capacitance: 1µF  [CAP 0805/2012]
C16  Capacitance: 1µF  [CAP 0805/2012]
C17  Capacitance: 1µF  [CAP 0805/2012]
C18  Capacitance: 1000µF  [CAPE5.0mm]
C19  Capacitance: 1000µF  [CAPE5.0mm]
C20  Capacitance: 1000µF  [CAPE5.0mm]
C21  Capacitance: 1000µF  [CAPE5.0mm]
C22  Capacitance: 1000µF  [CAPE5.0mm]
C23  Capacitance: 1000µF  [CAPE5.0mm]
C24  Capacitance: 1000µF  [CAPE5.0mm]
C25  Capacitance: 1000µF  [CAPE5.0mm]
C26  Capacitance: 1µF  [CAP 0805/2012]
C27  Capacitance: 1µF  [CAP 0805/2012]
C28  Capacitance: 1µF  [CAP 0805/2012]
C29  Capacitance: 1µF  [CAP 0805/2012]
C30  Capacitance: 1µF  [CAP 0805/2012]
C31  Capacitance: 1µF  [CAP 0805/2012]
D14  Supplier Part Number 1: S3D-DIO  [DIODE-SMC]
D15  Supplier Part Number 1: S3D-DIO  [DIODE-SMC]
D16  Supplier Part Number 1: S3D-DIO  [DIODE-SMC]
D17  Supplier Part Number 1: S3D-DIO  [DIODE-SMC]
D18  Supplier Part Number 1: S3D-DIO  [DIODE-SMC]
D19  Supplier Part Number 1: S3D-DIO  [DIODE-SMC]
D20  Supplier Part Number 1: S3D-DIO  [DIODE-SMC]
D21  Supplier Part Number 1: S3D-DIO  [DIODE-SMC]
D22  Supplier Part Number 1: S3D-DIO  [DIODE-SMC]
D23  Supplier Part Number 1: S3D-DIO  [DIODE-SMC]
D24  Supplier Part Number 1: S3D-DIO  [DIODE-SMC]
D25  Supplier Part Number 1: S3D-DIO  [DIODE-SMC]
D26  Supplier Part Number 1: S3D-DIO  [DIODE-SMC]
D27  Supplier Part Number 1: S3D-DIO  [DIODE-SMC]
U5  Supplier Part Number 1: MC7805ACD2TG  [D2PAK-3]
U6  Supplier Part Number 1: MC7812ACD2TG  [D2PAK-3]
U7  Supplier Part Number 1: MC7812ACD2TG  [D2PAK-3]
U8  Supplier Part Number 1: MC7812ACD2TG  [D2PAK-3]
U9  Supplier Part Number 1: MC7912ACD2TG  [D2PAK-3]
U10  Supplier Part Number 1: MC7912ACD2TG  [D2PAK-3]
U11  Supplier Part Number 1: MC7912ACD2TG  [D2PAK-3]
VR1  (no value)  [CAP 1206/3216 - 1.8MM]
VR2  (no value)  [CAP 1206/3216 - 1.8MM]

### Ports
5v (out), 12v (out), +Vun (out), -12v (out), -Vun (out), LV_AC_N (in), LV_AC_P (in)

### Nets
5v: C11.1 U5.3(VO) ; port 5v
12v: D14.K D15.K D16.K ; port 12v
+Vun: C18.1 C19.1 C20.1 D17.A D19.K D20.K VR1.1 ; port +Vun
-12v: D25.A D26.A D27.A ; port -12v
-Vun: C22.2 C23.2 C24.2 D22.A D23.A D24.K VR2.2 ; port -Vun
GND: C10.2 C11.2 C18.2 C19.2 C20.2 C21.2 C22.1 C23.1 C24.1 C25.1 D18.K D21.A U5.2 VR1.2 VR2.1
NetC10_1: C10.1 C12.1 C14.1 C16.1 C21.1 D17.K U5.1(VI) U6.1(VI) U7.1(VI) U8.1(VI)
NetC12_2: C12.2 C13.2 C14.2 C15.2 C16.2 C17.2 D18.A U6.2 U7.2 U8.2
NetC13_1: C13.1 D15.A U6.3(VO)
NetC15_1: C15.1 D16.A U7.3(VO)
NetC17_1: C17.1 D14.A U8.3(VO)
NetC25_2: C25.2 C28.2 C30.2 C31.2 D24.A U9.2(VI) U10.2(VI) U11.2(VI)
NetC26_1: C26.1 C27.1 C28.1 C29.1 C30.1 C31.1 D21.K U9.1 U10.1 U11.1
NetC26_2: C26.2 D25.K U9.3(VO)
NetC27_2: C27.2 D26.K U10.3(VO)
NetC29_2: C29.2 D27.K U11.3(VO)
NetD19_A: D19.A D22.K ; port LV_AC_P
NetD20_A: D20.A D23.K ; port LV_AC_N

### Notes on the sheet
- Title
- Size:
- Date:
- A4
- Number:
- Time:
- Revision:
- Sheet
- of
- Fermium LABS srl
- Via Monselice 15a
- 35142 Padova PD
- Italy
- File:
- (in symbol L7805-TO220) GND
- (in symbol L7815-TO220) GND
- (in symbol L7915-TO220) GND
- (in symbol Varistor_MOV) V

### Library data of the parts
C10-C17 C26-C31 = Cap2: as C7 on sheet mcu; Published: 23-Sep-2002; PackageReference: CAPR5-4X5; Publisher: Altium Limited; PackageDescription: Capacitor; 2 Leads; Supplier 1: TME; Supplier Part Number 1: CL21B105KAFNNNE; Category: 0805 MLCC SMD Capacitors; Stock 1: 56790; Pricing 1: 100=0.0108, 300=0.00924, 1000=0.00748, 2000=0.006, 6000=0.0058 (EUR); Weight: 0.039; Multiples: 100; Mounting: SMD; Operating temperature: -55...125°C; Price Type: NET; ComponentLink1URL: http://static.tme.eu/products_pics/d/b/b/dbbd93eaf25225110ca26eb66da77328/58538.jpg; ComponentLink1Description: http://static.tme.eu/products_pics/d/b/b/dbbd93eaf25225110ca26eb66da77328/58538.jpg
C18-C23 C25 = Cap Pol1: capacitor , electrolytic; Manufacturer: NICHICON; Manufacturer Part Number: UVZ1V102MHD; Unit: pcs; SuppliedAmount: 0; MinAmount: 5; Multiples: 1; Operating voltage: 35V DC; Tolerance: ±20%; Service life: 1000h; Operating current max.: 810mA; Pads: 2 THT; Published: 8-Jun-2000; LatestRevisionDate: 17-Jul-2002; LatestRevisionNote: Re-released for DXP Platform.; PackageReference: RB7.6-15; Publisher: Altium Limited; PackageDescription: 10pitch; Supplier 1: TME; Supplier Part Number 1: UVZ1V102MHD; Category: 105°C THT Electrolytic Capacitors; Stock 1: 0; Pricing 1: 5=0.33643, 25=0.28487, 100=0.21269, 400=0.19593 (EUR); Weight: 3.7; Capacitor type: electrolytic; Mounting: THT; Body dimensions: Ø12.5 x 20mm; Terminal pitch: 5mm; Operating temperature: -55...105°C; Price Type: NET; ComponentLink1URL: http://static.tme.eu/products_pics/c/5/f/c5fef3dcb868d5f42dbf93bcba194bc3/52948.jpg; ComponentLink1Description: http://static.tme.eu/products_pics/c/5/f/c5fef3dcb868d5f42dbf93bcba194bc3/52948.jpg; Supplier 2: TME; Supplier Part Number 2: UVR1V102MHD; Stock 2: 838; Pricing 2: 25=0.24372, 100=0.18546, 400=0.1709, 1600=0.15536 (EUR); ComponentLink2URL: http://static.tme.eu/products_pics/9/d/3/9d3c8a28bff4572cbe0221dcc6b489cc/52582.jpg; ComponentLink2Description: http://static.tme.eu/products_pics/9/d/3/9d3c8a28bff4572cbe0221dcc6b489cc/52582.jpg
C24 = Cap Pol1: capacitor , electrolytic; Manufacturer: NICHICON; Manufacturer Part Number: UVZ1V102MHD; Unit: pcs; SuppliedAmount: 0; MinAmount: 5; Multiples: 1; Operating voltage: 35V DC; Tolerance: ±20%; Service life: 1000h; Operating current max.: 810mA; 2 THT: Pads; Pads: 2 THT; Published: 8-Jun-2000; LatestRevisionDate: 17-Jul-2002; LatestRevisionNote: Re-released for DXP Platform.; PackageReference: RB7.6-15; Publisher: Altium Limited; PackageDescription: 10pitch; Supplier 1: TME; Supplier Part Number 1: UVZ1V102MHD; Category: 105°C THT Electrolytic Capacitors; Stock 1: 0; Pricing 1: 5=0.33643, 25=0.28487, 100=0.21269, 400=0.19593 (EUR); Weight: 3.7; Capacitor type: electrolytic; Mounting: THT; Body dimensions: Ø12.5 x 20mm; Terminal pitch: 5mm; Operating temperature: -55...105°C; Price Type: NET; ComponentLink1URL: http://static.tme.eu/products_pics/c/5/f/c5fef3dcb868d5f42dbf93bcba194bc3/52948.jpg; ComponentLink1Description: http://static.tme.eu/products_pics/c/5/f/c5fef3dcb868d5f42dbf93bcba194bc3/52948.jpg; Supplier 2: TME; Supplier Part Number 2: UVR1V102MHD; Stock 2: 838; Pricing 2: 25=0.24372, 100=0.18546, 400=0.1709, 1600=0.15536 (EUR); ComponentLink2URL: http://static.tme.eu/products_pics/9/d/3/9d3c8a28bff4572cbe0221dcc6b489cc/52582.jpg; ComponentLink2Description: http://static.tme.eu/products_pics/9/d/3/9d3c8a28bff4572cbe0221dcc6b489cc/52582.jpg
D14-D27 = Diode 1N4007: Diode rectifier 1A; Manufacturer: DIOTEC SEMICONDUCTOR; Manufacturer Part Number: S3D; Pads: 2 SMD; Supplier 1: TME; Case: DO214AB
U5 = L7805-TO220: Voltage regulator, 5V; Manufacturer: ON SEMICONDUCTOR; Unit: pcs; SuppliedAmount: 0; MinAmount: 2; Multiples: 1; Integrated circuit type: voltage stabiliser; Kind of voltage regulator: fixed; Output current: 1A; Pads: 3 SMD; Supplier 1: TME; Manufacturer Part Number: MC7805ACD2TG; Category: Unregulated Voltage Regulators; Stock 1: 245; Pricing 1: 2=0.45, 10=0.42, 50=0.38, 250=0.322 (EUR); Weight: 2.18; Output voltage: 5V; Case: D2PAK; Mounting: SMD; Package type: tube; Price Type: NET; ComponentLink1URL: http://static.tme.eu/products_pics/e/a/8/ea8bf400c57f85e1fa510dcd027ce484/59301.jpg; ComponentLink1Description: http://static.tme.eu/products_pics/e/a/8/ea8bf400c57f85e1fa510dcd027ce484/59301.jpg
U6-U8 = L7815-TO220: Voltage regulator, 15V; Manufacturer: ON SEMICONDUCTOR; Unit: pcs; SuppliedAmount: 0; MinAmount: 1; Integrated circuit type: voltage stabiliser; Kind of voltage regulator: fixed; Output voltage: 12V; Output current: 1A; Pads: 3 SMD; Supplier 1: TME; Manufacturer Part Number: MC7812ACD2TG; Category: Unregulated Voltage Regulators; Stock 1: 415; Pricing 1: 1=0.5, 5=0.449, 25=0.41, 100=0.357, 500=0.299 (EUR); Weight: 1.997; Multiples: 1; Case: D2PAK; Mounting: SMD; Package type: tube; Price Type: NET; ComponentLink1URL: http://static.tme.eu/products_pics/e/a/8/ea8bf400c57f85e1fa510dcd027ce484/59301.jpg; ComponentLink1Description: http://static.tme.eu/products_pics/e/a/8/ea8bf400c57f85e1fa510dcd027ce484/59301.jpg
U9-U11 = L7915-TO220: Voltage regulator-15.0V; Manufacturer: ON SEMICONDUCTOR; Unit: pcs; SuppliedAmount: 0; MinAmount: 1; Integrated circuit type: voltage stabiliser; Kind of voltage regulator: fixed; Output voltage: -12V; Output current: 1A; Pads: 3 SMD; Supplier 1: TME; Manufacturer Part Number: MC7912ACD2TG; Category: Unregulated Voltage Regulators; Stock 1: 441; Pricing 1: 1=0.628, 5=0.56, 25=0.465, 100=0.39, 500=0.34 (EUR); Weight: 1.876; Multiples: 1; Case: D2PAK; Mounting: SMD; Package type: tube; Price Type: NET; ComponentLink1URL: http://static.tme.eu/products_pics/e/a/8/ea8bf400c57f85e1fa510dcd027ce484/59301.jpg; ComponentLink1Description: http://static.tme.eu/products_pics/e/a/8/ea8bf400c57f85e1fa510dcd027ce484/59301.jpg
VR1 VR2 = Varistor_MOV: Varistor; Manufacturer: EPCOS; Manufacturer Part Number: B72520T0250K062; Unit: pcs; SuppliedAmount: 0; MinAmount: 5; Multiples: 1; Varistor type: metal-oxide; Max. operating voltage: 25V AC; Energy 2 ms: 1J; Varistor max current 8/20µs: 200A; Power: 8mW; Pads: 2 SMD; Supplier 1: TME; Supplier Part Number 1: B72520T250K62; Category: SMD Varistors; Stock 1: 1646; Pricing 1: 5=0.194, 50=0.158, 100=0.128, 500=0.119, 2000=0.114 (EUR); Weight: 0.058; Mounting: SMD; Case: 1206; Price Type: NET; ComponentLink1URL: http://static.tme.eu/products_pics/c/0/9/c09a96f753270fa18ba9e61c943ff8c8/58311.jpg; ComponentLink1Description: http://static.tme.eu/products_pics/c/0/9/c09a96f753270fa18ba9e61c943ff8c8/58311.jpg